# Altium project Multivibrator.PrjPCB
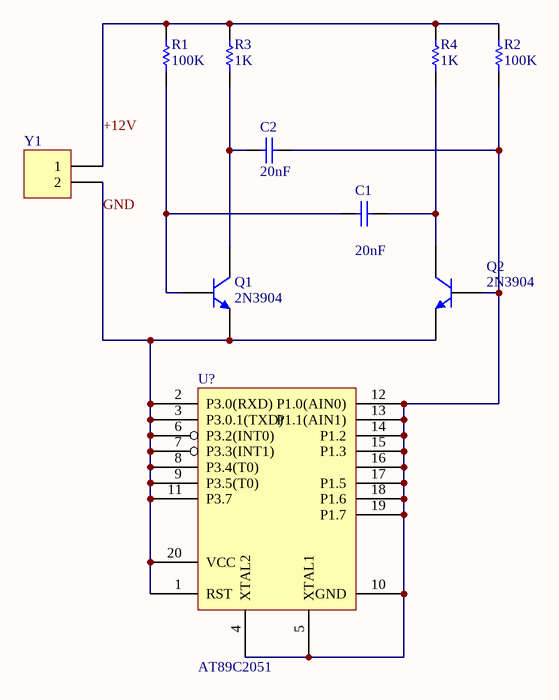
[diagram p0: Multivibrator.SchDoc]
1 sheet, 10 parts. Net scope: global (net labels, ports and power ports of the same name join across sheets).
Board files: Multivibrator.PcbDoc, PCB1.PcbDoc

## Sheet Multivibrator.SchDoc
size A4

### Parts
C1  20nF  [RAD-0.3]
C2  20nF  [RAD-0.3]
Q1  2N3904  [TO-92A]
Q2  2N3904  [TO-92A]
R1  100K  [AXIAL-0.3]
R2  100K  [AXIAL-0.3]
R3  1K  [AXIAL-0.3]
R4  1K  [AXIAL-0.3]
U?  AT89C2051  [DIP20]
Y1  Header 2  [HDR1X2]  (value not drawn)

### Nets
+12V: R1.2 R2.2 R3.2 R4.2 Y1.1
GND: Q1.1(E) Q2.1(E) U?.1(RST) U?.2(P3.0(RXD)) U?.3(P3.0.1(TXD)) U?.6(P3.2(INT0)) U?.7(P3.3(INT1)) U?.8(P3.4(T0)) U?.9(P3.5(T0)) U?.11(P3.7) U?.20(VCC) Y1.2
NetC1_1: C1.1 Q1.2(B) R1.1
NetC1_2: C1.2 Q2.3(C) R4.1
NetC2_1: C2.1 Q1.3(C) R3.1
NetC2_2: C2.2 Q2.2(B) R2.1 U?.4(XTAL2) U?.5(XTAL1) U?.10(GND) U?.12(P1.0(AIN0)) U?.13(P1.1(AIN1)) U?.14(P1.2) U?.15(P1.3) U?.16 U?.17(P1.5) U?.18(P1.6) U?.19(P1.7)

### Library data of the parts
C1 C2 = Cap: Capacitor; Published: 8-Jun-2000; LatestRevisionDate: 17-Jul-2002; LatestRevisionNote: Re-released for DXP Platform.; PackageReference: RAD-0.3; Publisher: Altium Limited; Value: 20nF
Q1 Q2 = 2N3904: NPN General Purpose Amplifier; Published: 8-Jun-2000; LatestRevisionDate: 15-Jan-2003; LatestRevisionNote: PCB Footprint 'BCY-W3/D4.7' replaced; DatasheetDocument: 1997; PackageDocument: Sep-1998; PackageReference: TO-92A; Publisher: Altium Limited; Code_JEDEC: TO-92A; ComponentLink1Description: Manufacturer Link; ComponentLink1URL: http://www.fairchildsemi.com/; ComponentLink2Description: Datasheet; ComponentLink2URL: http://www.fairchildsemi.com/ds/2N%2F2N3904.pdf
R1-R4 = Res1: Resistor; Published: 8-Jun-2000; LatestRevisionDate: 17-Jul-2002; LatestRevisionNote: Re-released for DXP Platform.; PackageReference: AXIAL-0.3; Publisher: Altium Limited
  R1 R2: Value: 100K
  R3 R4: Value: 1K
U? = AT89C2051: 单片机AT89C2051; Published: 8-Jun-2000; LatestRevisionDate: 17-Jul-2002; LatestRevisionNote: Re-released for DXP Platform.; DatasheetDocument: 1997; PackageReference: DO-35; Publisher: Altium Limited; Code_JEDEC: DO-204-AH; ComponentLink1Description: Manufacturer Link; ComponentLink1URL: http://www.fairchildsemi.com/; ComponentLink2Description: Datasheet; ComponentLink2URL: http://www.fairchildsemi.com/ds/1N%2F1N4448.pdf
Y1 = Header 2: Header, 2-Pin; LatestRevisionDate: 17-Jul-2002; LatestRevisionNote: Re-released for DXP Platform.; Publisher: Altium Limited